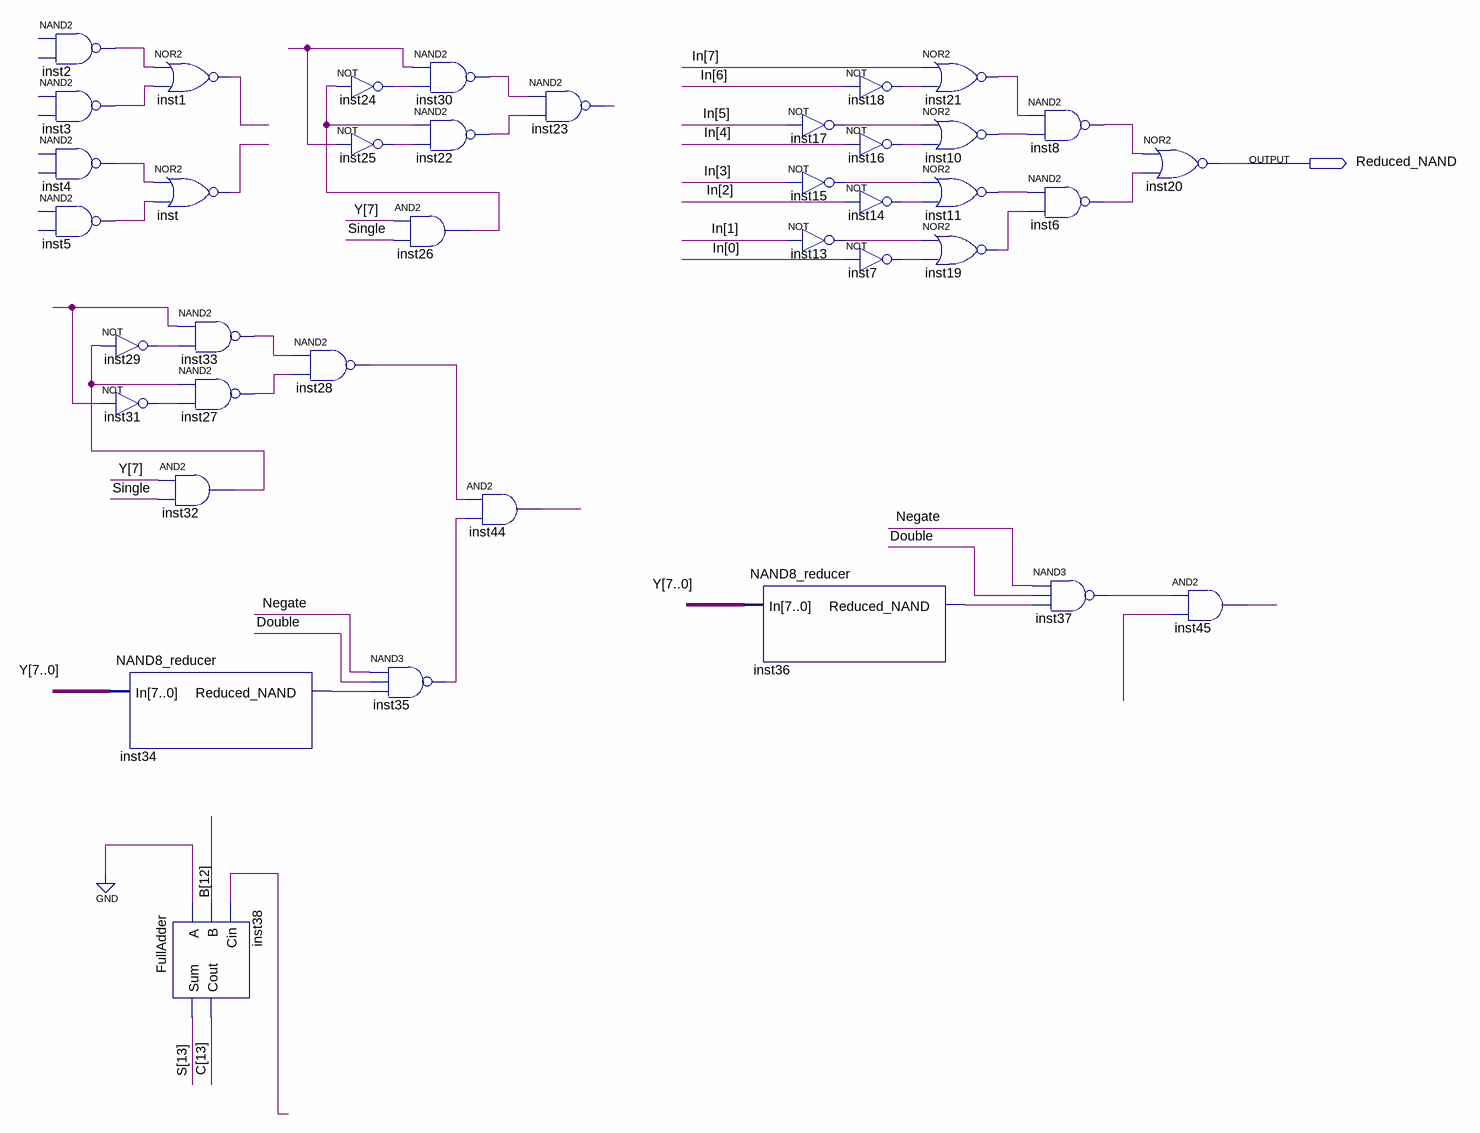
[diagram p0: schematic sheet]
// Quartus schematic parts.bdf as structural Verilog: 39 symbols, 1 pins
module parts (
  output Reduced_NAND
);

  wire Double, inst1_out, inst2_out, inst3_out, inst4_out, inst5_out, inst6_out, inst7_out, inst8_out,
       inst10_out, inst11_out, inst13_out, inst14_out, inst15_out, inst16_out, inst17_out, inst18_out,
       inst19_out, inst21_out, inst22_out, inst23_out, inst24_out, inst25_out, inst26_out, inst27_out,
       inst28_out, inst29_out, inst30_out, inst31_out, inst32_out, inst33_out, inst34_reduced_nand,
       inst35_out, inst36_reduced_nand, inst37_out, inst44_out, inst45_out, inst_out, Negate, Single,
       undriven, undriven_2, undriven_3, undriven_4;
  wire [7:0] In, Y;
  wire [12:12] B;
  wire [13:13] C, S;

  // NAND2 inst2 has open pins: IN1=open, IN2=open, OUT=inst2_out
  // NAND2 inst3 has open pins: IN1=open, IN2=open, OUT=inst3_out
  // NAND2 inst4 has open pins: IN1=open, IN2=open, OUT=inst4_out
  // NAND2 inst5 has open pins: IN1=open, IN2=open, OUT=inst5_out
  not inst29 (inst29_out, inst32_out);
  not inst31 (inst31_out, undriven_2);
  NAND8_reducer inst34 (.In(Y), .Reduced_NAND(inst34_reduced_nand));
  nor inst1 (inst1_out, inst2_out, inst3_out);
  nor inst (inst_out, inst4_out, inst5_out);
  nand inst33 (inst33_out, undriven_2, inst29_out);
  nand inst27 (inst27_out, inst32_out, inst31_out);
  and inst32 (inst32_out, Y[7], Single);
  FullAdder inst38 (.A(1'b0), .B(B[12]), .Cin(undriven_4), .Sum(S[13]), .Cout(C[13]));
  nand inst28 (inst28_out, inst33_out, inst27_out);
  not inst24 (inst24_out, inst26_out);
  not inst25 (inst25_out, undriven);
  nand inst35 (inst35_out, Negate, Double, inst34_reduced_nand);
  nand inst30 (inst30_out, undriven, inst24_out);
  nand inst22 (inst22_out, inst26_out, inst25_out);
  and inst26 (inst26_out, Y[7], Single);
  nand inst23 (inst23_out, inst30_out, inst22_out);
  and inst44 (inst44_out, inst28_out, inst35_out);
  NAND8_reducer inst36 (.In(Y), .Reduced_NAND(inst36_reduced_nand));
  not inst17 (inst17_out, In[5]);
  not inst15 (inst15_out, In[3]);
  not inst13 (inst13_out, In[1]);
  not inst18 (inst18_out, In[6]);
  not inst16 (inst16_out, In[4]);
  not inst14 (inst14_out, In[2]);
  not inst7 (inst7_out, In[0]);
  nor inst21 (inst21_out, In[7], inst18_out);
  nor inst10 (inst10_out, inst17_out, inst16_out);
  nor inst11 (inst11_out, inst15_out, inst14_out);
  nor inst19 (inst19_out, inst13_out, inst7_out);
  nand inst8 (inst8_out, inst21_out, inst10_out);
  nand inst6 (inst6_out, inst11_out, inst19_out);
  nand inst37 (inst37_out, Negate, Double, inst36_reduced_nand);
  nor inst20 (Reduced_NAND, inst8_out, inst6_out);
  and inst45 (inst45_out, inst37_out, undriven_3);
endmodule
